# Altium schematic sheet SmilePCBschem.SchDoc
size A; SheetNumber: 1; SheetTotal: 1
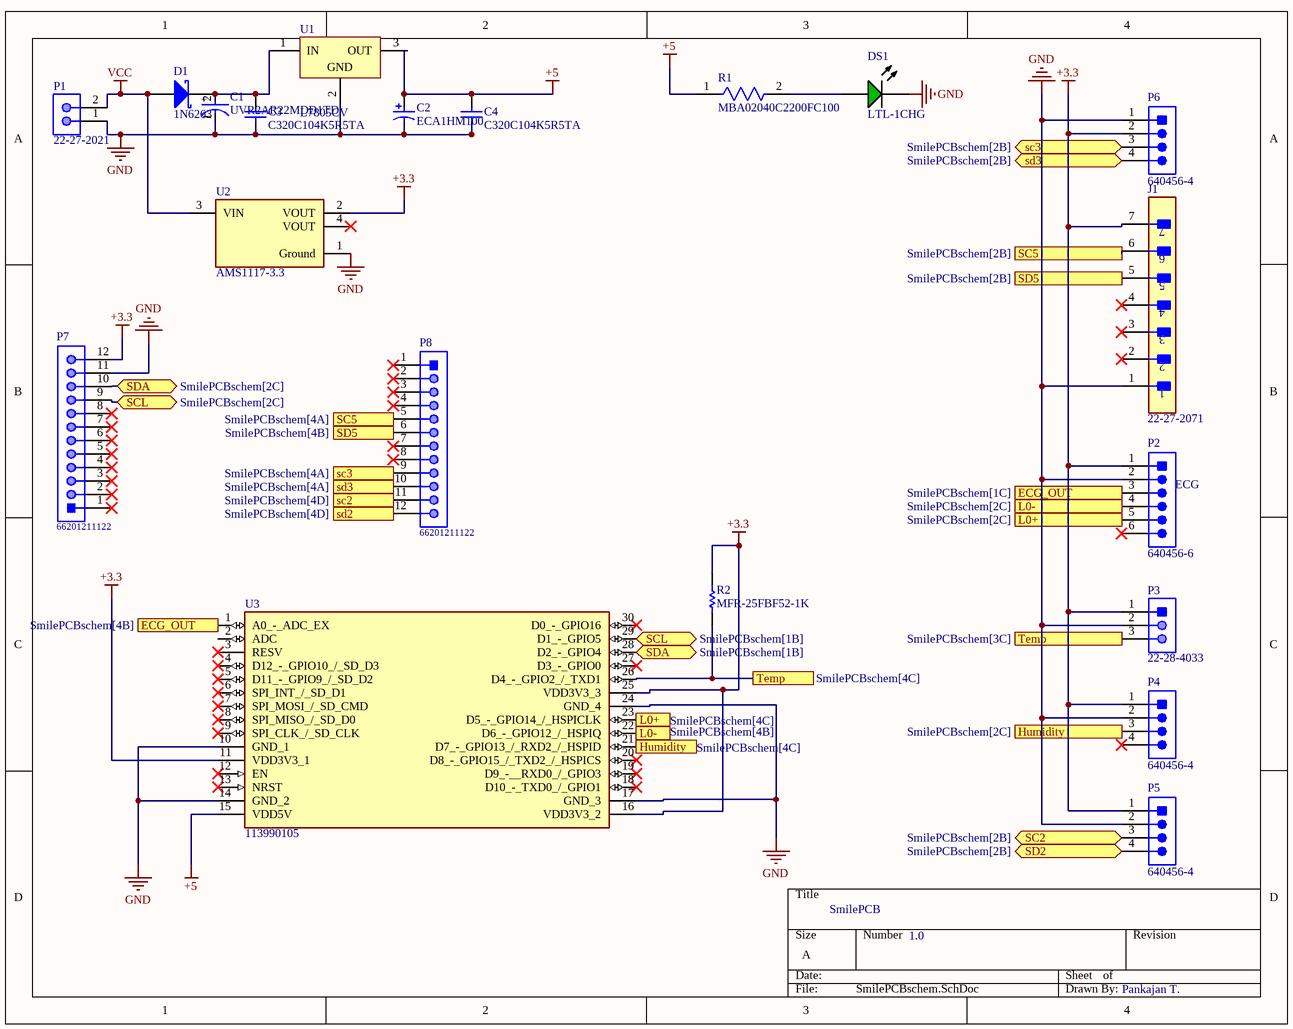
[diagram p0: SmilePCBschem.SchDoc]

## Parts
C1  UVR2AR22MDD1TD  [FP-UVR2AR22MDD1TD-MFG]
C2  ECA1HM100  [CAPPR55-200-1100X500X1200]
C3  C320C104K5R5TA  [CAPR51-254-508X318X736]
C4  C320C104K5R5TA  [CAPR51-254-508X318X736]
D1  1N6263  [STM-DO-35-2]
DS1  LTL-1CHG  [LTST-LTL-1CHG-2]
J1  22-27-2071  [FP-22-27-2071-MFG]
P1  22-27-2021  [MOLX-22-27-2021_V]
P2  640456-6  [TECO-640456-6_V]
P3  22-28-4033  [MOLX-22-28-4033_V]
P4  640456-4  [TECO-640456-4]
P5  640456-4  [TECO-640456-4]
P6  640456-4  [TECO-640456-4]
P7  66201211122  [66201211122]
P8  66201211122  [66201211122]
R1  MBA02040C2200FC100  [FP-MBA0204-MFG]
R2  MFR-25FBF52-1K  [RESA60-630X240]
U1  L7805CV  [TO220]
U2  AMS1117-3.3  [FP-AMS1117-IPC_C]
U3  113990105  [113990105]

## Ports
ECG_OUT (see SmilePCBschem[1C]), ECG_OUT (see SmilePCBschem[4B]), Humidity (see SmilePCBschem[2C]), Humidity (see SmilePCBschem[4C]), L0+ (see SmilePCBschem[2C]), L0+ (see SmilePCBschem[4C]), L0- (see SmilePCBschem[2C]), L0- (see SmilePCBschem[4B]), SC2 (bidir, see SmilePCBschem[2B]), sc2 (see SmilePCBschem[4D]), sc3 (bidir, see SmilePCBschem[2B]), sc3 (see SmilePCBschem[4A]), SC5 (see SmilePCBschem[2B]), SC5 (see SmilePCBschem[4A]), SCL (bidir, see SmilePCBschem[1B]), SCL (bidir, see SmilePCBschem[2C]), SD2 (bidir, see SmilePCBschem[2B]), sd2 (see SmilePCBschem[4D]), sd3 (bidir, see SmilePCBschem[2B]), sd3 (see SmilePCBschem[4A]), SD5 (see SmilePCBschem[2B]), SD5 (see SmilePCBschem[4B]), SDA (bidir, see SmilePCBschem[1B]), SDA (bidir, see SmilePCBschem[2C]), Temp (see SmilePCBschem[3C]), Temp (see SmilePCBschem[4C])

## Nets
+3.3: J1.7 P2.1 P3.1 P4.1 P5.1 P6.2 P7.12 R2.2 U2.2(VOUT) U3.11(VDD3V3_1) U3.16(VDD3V3_2) U3.25(VDD3V3_3)
+5: C2.1 C4.2 R1.1 U1.3(OUT) U3.15(VDD5V)
GND: C1.1(C) C2.2 C3.1 C4.1 DS1.2(K) J1.1 P1.1 P2.2 P3.2 P4.2 P5.2 P6.1 P7.11 U1.2(GND) U2.1(Ground) U3.10(GND_1) U3.14(GND_2) U3.17(GND_3) U3.24(GND_4)
VCC: D1.1(A) P1.2 U2.3(VIN)
ECG_OUT: P2.3 U3.1(A0_-_ADC_EX) ; port ECG_OUT
Humidity: P4.3 U3.21(D7_-_GPIO13_/_RXD2_/_HSPID) ; port Humidity
L0+: P2.5 U3.23(D5_-_GPIO14_/_HSPICLK) ; port L0+
L0-: P2.4 U3.22(D6_-_GPIO12_/_HSPIQ) ; port L0-
SC2: P5.3 P8.11 ; port SC2, port sc2
sc3: P6.3 P8.9 ; port sc3
SC5: J1.6 P8.5 ; port SC5
SCL: P7.9 U3.29(D1_-_GPIO5) ; port SCL
SD2: P5.4 P8.12 ; port SD2, port sd2
sd3: P6.4 P8.10 ; port sd3
SD5: J1.5 P8.6 ; port SD5
SDA: P7.10 U3.28(D2_-_GPIO4) ; port SDA
Temp: P3.3 R2.1 U3.26(D4_-_GPIO2_/_TXD1) ; port Temp
NetC1_2: C1.2(A) C3.2 D1.2(K) U1.1(IN)
NetDS1_1: DS1.1(A) R1.2

Not connected (* = marked no-connect by the designer): J1 2* 3* 4*; P2 6*; P4 4*; P7 1* 2* 3* 4* 5* 6* 7* 8*; P8 1* 2* 3* 4* 7* 8*; U2 4(VOUT)*; U3 2(ADC) 3(RESV)* 4(D12_-_GPIO10_/_SD_D3)* 5(D11_-_GPIO9_/_SD_D2)* 6(SPI_INT_/_SD_D1)* 7(SPI_MOSI_/_SD_CMD)* 8(SPI_MISO_/_SD_D0)* 9(SPI_CLK_/_SD_CLK)* 12(EN)* 13(NRST)* 18(D10_-_TXD0_/_GPIO1)* 19(D9_-__RXD0_/_GPIO3)* 20(D8_-_GPIO15_/_TXD2_/_HSPICS)* 27(D3_-_GPIO0)* 30(D0_-_GPIO16)*

## Notes on the sheet
- (near P2) ECG
- SmilePCB
- 1.0
- Pankajan T.
- (in symbol CMP-12462-000035-1) +

## Library data of the parts
C1 = CMP-12462-000035-1: CAP ALUM 0.22UF 20% 100V RADIAL; Ripple Current: 4.7mA; Life (Hours): 2000Hour; Dielectric Material: Aluminium; Capacitance: 220nF; Dissipation Factor: 0.08%; Lead/Base Style: Straight; Series: VR; Length: 11mm; Package Quantity: 2000; Height - Seated (Max): 0.492inch; Termination: Radial; Height: 11mm; Tolerance: 20%; Voltage Rating (DC): 100V; Min Operating Temperature: -40°C; Voltage Rating: 100V; RoHS Compliant: Yes; Mount: Through Hole; REACH SVHC: No SVHC; Case/Package: Radial; Diameter: 5mm; Packaging: Tape and Reel; Lead Pitch: 2mm; Max Operating Temperature: 85°C
C2 = CMP-1665-00038-2: Aluminum Electrolytic Capacitor, 10 uF, +/- 20%, 50 V, -40 to 85 degC, 2-Pin THD, RoHS, Bulk; Manufacturer: Panasonic; Life (Hours): 2000Hour; Lead/Base Style: Straight; Dissipation Factor: 0.12%; Capacitance: 10uF; Leakage Current: 3uA; Dielectric Material: Aluminium; Lead Diameter: 0.5mm; Voltage Rating: 50V; Ripple Current: 65mA; Package Reference: CAPPR55-200-1100X500X1200; Height: 11mm; Diameter: 5mm; REACH SVHC: NoSVHC; Mount: ThroughHole; Packaging: Bulk; Manufacturer URL: http://www.panasonic.com/; Termination: Radial; Datasheet URL: https://industrial.panasonic.com/cdbs/www-data/pdf/RDF0000/ABA0000C1218.pdf; Lead Free: LeadFree; Height - Seated (Max): 0.472inch; Case/Package: Radial; Package Description: 2-Pin Radial Lead, Dia 5 mm, Height 12 mm; Tolerance: 20%; Datasheet Version: Rev. 05, 10/2016; Package Quantity: 200; Ripple Current (AC): 65mA; Min Operating Temperature: -40degC; RoHSCompliant: true; Number of Pins: 2; Max Operating Temperature: 85degC; Voltage: 50V; Lead Pitch: 2mm; Radiation Hardening: No; Voltage Rating (DC): 50V; Length: 11mm
C3 C4 = CMP-1664-00004-1: Radial Leaded Multilayer Ceramic Capacitor, 0.1 uF, +/- 10%, 50 V, -55 to 125 degC, 2-Pin THD, RoHS, Tape and Reel; Case\Package: SOT-23-5; Max Power Dissipation: 250 mW; Output Current: 150 mA; Dropout Voltage: 260 mV; Outputs: 1; Output Voltage: 5 V; Max Input Voltage: 8 V; Min Operating Temperature: -40 degC; Packaging: Tape and Reel; Height: 1.3 mm; Radiation Hardening: No; Pins: 5; ComponentLink1Description: Manufacturer URL; Mount: Surface Mount; RoHSCompliant: true; Max Operating Temperature: 85 degC; PackageReference: CAPR51-254-508X318X736; ComponentLink2URL: http://www.kemet.com/docfinder?Partnumber=C320C104K5R5TA; PackageDescription: 2-Pin Through Hole Device, Body 5.08 x 3.18 mm, Pitch 2.54 mm; ComponentLink1URL: http://www.kemet.com/; Width: 1.8 mm; Package Quantity: 3000; DatasheetVersion: Dec-15; Length: 3 mm; ComponentLink2Description: Datasheet
D1 = CMP-2000-05522-1: Small Signal Schottky Diode, 15 mA, 1 V, -65 to 200 degC, 2-Pin DO-35, RoHS, Tape and Reel; Manufacturer: STMicroelectronics; Forward Current If(AV): 15mA; Forward Voltage VF Max: 410mV; Repetitive Reverse Voltage Vrrm Max: 60V; Diode Configuration: Single; Product Range: 1N6263Series; No. of Pins: 2Pins; Diode Case Style: DO-204AH; Forward Surge Current Ifsm Max: 50mA; SVHC: NoSVHC(17-Dec-2015); Datasheet Version: 10/2001; Mounting Technology: ThroughHole; Package Description: 2-Pin Axial Lead, Dia 1.765 mm, Body Length 3.775 mm; Manufacturer URL: http://www.st.com/; Operating Temperature Max: 200°C; Automotive Qualification Standard: -; Package Reference: DO-35-2; Packaging: Each; Datasheet URL: http://www.st.com/resource/en/datasheet/1n6263.pdf
DS1 = CMP-1674-00014-1: LITE-ON Electronic, INC, 120 mA, 100 mW, 5 V, -55 to 100 degC, 2-Pin THD, RoHS, Bulk; Case\Package: QFN; Max Supply Voltage: 3.6 V; Interface: I2C; Min Supply Voltage: 2.5 V; ComponentLink1URL: http://www.us.liteon.com/; DatasheetVersion: Mar-00; Max Operating Temperature: 85 degC; ComponentLink2URL: http://datasheet.octopart.com/LTL-1CHG-Lite-On-datasheet-143841.pdf; Min Operating Temperature: -40 degC; PackageReference: LTL-1CHG; RoHSCompliant: true; Pins: 24; PackageDescription: 2-Pin Through Hole Device, Dia 3.8 mm; ComponentLink1Description: Manufacturer URL; Packaging: Cut Tape; ComponentLink2Description: Datasheet; Package Quantity: 5000; REACH SVHC: No SVHC
J1 = CMP-04776-000328-1: CONN HEADER VERT 7POS 2.54MM; Contact Resistance: 10mR; Number of Positions: 7; Glow Wire Compliant: Non-compliant; Current Rating: 4A; Gender: Male; Connector Type: Male Pin; Voltage Rating: 250V; Insulation Resistance: 50GR; Number of Circuits: 7; Fastening Type: Friction; RoHS Compliant: Yes; Termination: Solder; Flammability Rating: UL94 V-0; Orientation: Straight; Packaging: Bulk; Housing Material: Nylon; Housing Color: White; Mount: Through Hole; Contact Plating: Tin; Package Quantity: 10; Depth: 5.8mm; Length: 5.08mm; Contact Material: Brass; Series: KK; Min Operating Temperature: 0°C; Contact Type: Male Pin; Max Current Rating: 4A; Contact Mating Length: 0.295inch; Number of Rows: 1; Color: Natural; Voltage Rating (DC): 250V; Max Voltage Rating (AC): 250V; Radiation Hardening: No; Height: 8.38mm; Max Operating Temperature: 75°C; Number of Contacts: 7; Pitch: 2.54mm; Lead Free: Lead Free; Halogen Free: Low Halogen
P1 = CMP-2000-05537-1: Male Header, Pitch 2.54 mm, 1 x 2 Position, Height 11.7 mm, Tail Length 3.56 mm, 0 to 75 degC, RoHS, Bulk; Manufacturer: Molex; PartNumber: 0022272021; Current rating: 4A; Package Version: Rev. BC, 02/2012; Voltage rating: 250V; No. of Positions: 2; Pitch: 2.54mm; No. of Rows: 1; Orientation: Vertical; Operating temperature: 0°Cto+75°C; Manufacturer URL: http://www.molex.com/; Mounting Technology: ThroughHole; Housing material: Nylon(UL94V-0); Package Description: 2-Leads Header, Body 5.08 x 5.8 mm, Pitch 2.54 mm; Voltage - Max: 250V; Datasheet URL: http://www.molex.com/pdm_docs/sd/022272021_sd.pdf; Package Reference: 22-27-2021; Contact material: Tinplatedbrass; Current - Max: 4A; Datasheet Version: Rev. F, 06/2009
P2 = CMP-2000-05661-1: Male Header, Pitch 2.54 mm, 1 x 6 Position, Height 10.03 mm, Tail Length 3.56 mm, -55 to 105 degC, Bulk; Manufacturer: TE Connectivity; Contact Centerline Spacing: 0.100 / in.; Number of Contacts: 6; Current, Rating: 5 / A; Agency Approvals: CSA,UL; Material, Contact: CopperAlloy; Mounting Hole Size: 0.04 / "; Brand/Series: MTA-100Series; Pin Spacing: 0.1 / "; Mount Angle: Vertical; Contact Termination Area Plating: Tin; Angle: Straight; Primary Type: InterconnectSystem; Standards: RoHSCompliant,ELVCompliant,UL94V-0; Temperature, Operating: -55to+105 / °C; Material, Housing: Polyester; Special Features: Pinstrip; Color, Housing: White; Connector Type: MTA-100; Voltage, Rating: 250 / V; Termination: Solder; Package Reference: 640456-6; Size, Post: 0.025 / in.; Color: White; Datasheet URL: https://datasheet.ciiva.com/25618/0900766b80eb7fdd-25618163.pdf; Manufacturer URL: http://www.te.com/; Mounting Type: PCMount; Length, Pin: 0.14 / "; Type: PCBPlug; Length, Overall: 0.6 / "; Mounting Technology: ThroughHole; Number of Rows: 1; Contact Shape: Square; Contact Mating Area Plating: Tin; Datasheet Version: Rev. W, 05/2005; Number of Positions: 6; Package Description: Male Header, Pitch 2.54 mm, 1 x 6 Position, Height 10.03 mm, Tail Length 3.56 mm; Contact Plating: Tin; Length, Terminal Post: 0.14 / in.; Flammability Rating: UL94V-0
P3 = CMP-1676-00001-5: Male Header, Pitch 2.54 mm, 1 x 3 Position, Height 8.38 mm, Tail Length 3.18 mm, RoHS, Bulk; Manufacturer: Molex; Rows: 1; Voltage Rating: 250 V; Current Rating: 4 A; Min Operating Temperature: 0 degC; Lead Pitch: 0.1 inch; Packaging: Bulk; Contact Finish: Gold; RoHSCompliant: true; Contact Material: Brass; PackageReference: 22-28-4033; REACH SVHC: Unknown; PackageDescription: Male Header, Pitch 2.54 mm, 1 x 3 Position, Height 8.38 mm, Tail Length 3.18 mm; ComponentLink2URL: http://www.molex.com/pdm_docs/sd/022284033_sd.pdf; Height: 8.38 mm; Mounting Technology: Through Hole; ComponentLink1Description: Manufacturer URL; Length: 7.62 mm; Mount: Through Hole; DatasheetVersion: Rev. G, 01/2012; Max Operating Temperature: 75 degC; ComponentLink2Description: Datasheet; Colour: Black; Pins: 3; Contact Plating: Gold; Package Quantity: 1; ComponentLink1URL: http://www.molex.com/
P4-P6 = CMP-2000-05419-1: Male Header, Pitch 2.54 mm, 1 x 4 Position, Height 10.03 mm, Tail Length 3.56 mm, RoHS, Bulk; Manufacturer: TE Connectivity; Material, Housing: Polyester; Primary Type: InterconnectSystem; Mount Angle: Vertical; Color, Housing: White; Current, Rating: 5 / A; Agency Approvals: CSA,UL; Contact Termination Area Plating: Tin; Temperature, Operating: -55to+105 / degC; Standards: RoHSCompliant,ELVCompliant,UL94V-0; Number of Positions: 4; Brand/Series: MTA-100Series; Angle: Straight; Pin Spacing: 0.1 / "; Material, Contact: CopperAlloy; Connector Type: MTA-100; Special Features: Pinstrip; Mounting Hole Size: 0.04 / "; Contact Centerline Spacing: 0.100 / in.; Voltage, Rating: 250 / V; Manufacturer URL: http://www.te.com/; Length, Pin: 0.14 / "; Length, Overall: 0.4 / "; Color: White; Flammability Rating: UL94V-0; Mounting Type: PCMount; Termination: Solder; Datasheet URL: https://datasheet.ciiva.com/16286/eng-ds-82056-mta-0608-16286228.pdf; Number of Contacts: 4; Contact Shape: Square; Contact Mating Area Plating: Tin; Length, Terminal Post: 0.14 / in.; Size, Post: 0.025 / in.; Contact Plating: Tin; Type: PCBPlug; Datasheet Version: Dec-14; Number of Rows: 1
P7 P8 = CMP-1502-00450-1: THT Male Header WR-MPC3, Vertical, Single Row, pitch 3 mm, 12 pins; Manufacturer: Wurth Elektronik; Pin Number: 12; Working Voltage: 250VAC; Contact Resistance: 10mOhm; Pitch: 3mm; Datasheet URL: https://katalog.we-online.de/em/datasheet/6620xx11122.pdf; Part Number: 66201211122; Manufacturer URL: http://www.we-online.de; Package Reference: 66201211122; Operating Temperature: -40to105degC; Gender: Male; Mounting Technology: THT; Publisher: WurthElektronik; Packaging: Tube; Orientation: Vertical
R1 = CMP-02408-000005-1: RES 220 OHM 0.4W 1% AXIAL; Manufacturer: Vishay BC Components; Automotive Grade: Grade 1; Value: 220Ω; Voltage Rating: 200V; Temperature Coefficient: 50ppm/°C; Power Rating: 0.25W; Digikey Description: RES 220 OHM 0.4W 1% AXIAL; Height: 1.6mm; Automotive: Yes; Lead Free: Yes; Mouser Description: Thin Film Resistors - Through Hole .4watt 220ohms 1% 1/8watt body size; Temperature Range Low: -55°C; ComponentLink2Description: Datasheet; Temperature: -55°C to +125°C; Device Class L3: Through-Hole Resistors; Manufacturer Part Number: MBA02040C2200FC100; Ipc Land Pattern Name: RESAD500W65L360D160; Octopart: https://octopart.com/mba02040c2200fc100-vishay-43743094; Series: MBA/SMA 0204; RoHS: TRUE; Tolerance: 1%; Package: MBA0204; Device Class L1: Passive Components; ComponentLink2URL: http://www.vishay.com/docs/28766/mbxsma.pdf; Category: Res; Composition: Metal Film; Device Class L2: Resistors; Temperature Range High: +125°C; Resistance: 220Ω
R2 = CMP-1659-00075-1: Axial Resistor, 1 KOhm, +/- 1%, 250 mW, -55 to 155 degC, 2-Pin THD, RoHS, Bulk; Voltage Rating: 250 V; Resistance: 10 kohm; Power Rating: 250 mW; ComponentLink2Description: Datasheet; RoHSCompliant: true; PackageReference: MFR-25; Case\Package: Axial; Max Operating Temperature: 155 degC; DatasheetVersion: Apr-13; Tolerance: 1%; ComponentLink1URL: http://www.yageo.com/; Length: 0.248 inch; ComponentLink2URL: http://www.yageo.com/documents/recent/Yageo%20LR_MFR_2013.pdf; Packaging: Bulk; Package Quantity: 200; PackageDescription: 2-Pin Axial Lead, Dia 2.4 mm, Body Length 6.3 mm; Min Operating Temperature: -55 degC; ComponentLink1Description: Manufacturer URL
U1 = CMP-0244-00483-1: Positive Voltage Regulator, 5V, 3-Pin TO-220; PackageDescription: TO, Thru-Hole, Vertical, Heatsink Mounted; 3 In-Line Leads; Pitch 2.54 mm; ComponentLink2Description: Datasheet; PackageReference: TO220; ComponentLink3URL: http://www.st.com/internet/com/TECHNICAL_RESOURCES/TECHNICAL_LITERATURE/PACKAGE_INFORMATION/CD00004649.pdf; DatasheetVersion: 16/11/2011; ComponentLink1Description: Manufacturer URL; ComponentLink1URL: http://www.st.com; PackageVersion: ver3.0; ComponentLink3Description: Package Specification; ComponentLink2URL: http://www.st.com/internet/com/TECHNICAL_RESOURCES/TECHNICAL_LITERATURE/DATASHEET/CD00000444.pdf
U2 = CMP-209535-000001-1: LDO Voltage Regulators 1A, 3.3V; Manufacturer: Advanced Monolithic Systems; Dropout Voltage: 1.1V; Output Type: Fixed; Nominal Supply Current: 5mA; Max Power Dissipation: 1.2W; Max Supply Voltage: 15V; Number Of Outputs: 1; Standoff Height: 0.64mm; Max Junction Temp: +125°C; Height: 1.8mm; Package: AMS1117; Device Class L2: Power Management ICs; ComponentLink2Description: Datasheet; ComponentLink2URL: http://www.advanced-monolithic.com/pdf/ds1117.pdf; Category: IC; RoHS: TRUE; Automotive: No; Device Class L1: Integrated Circuits (ICs); Output Current: 1A; Device Class L3: Voltage Regulators - Linear; Temperature: -40°C to +125°C; Output Voltage: 3.3V; Manufacturer Part Number: AMS1117-3.3; Temperature Range Low: -40°C; Octopart: https://octopart.com/ams1117-3.3-advanced+monolithic+systems-25899300; Lead Free: Yes; Ipc Land Pattern Name: SOT229P700X180-4; Temperature Range High: +125°C
U3 = 113990105: Undefined or Miscellaneous; Manufacturer_Name: Seeed Studio; Datasheet Link: https://www.seeedstudio.com/NodeMCU-v2-Lua-based-ESP8266-development-kit.html; Height: 7.35mm; Manufacturer_Part_Number: 113990105; Mouser Part Number: 713-113990105; Mouser Price/Stock: https://www.mouser.co.uk/ProductDetail/Seeed-Studio/113990105?qs=SElPoaY2y5KMx8k1roAIKw%3D%3D; Arrow Part Number: 113990105; Arrow Price/Stock: https://www.arrow.com/en/products/113990105/seeed-technology-limited?region=nac